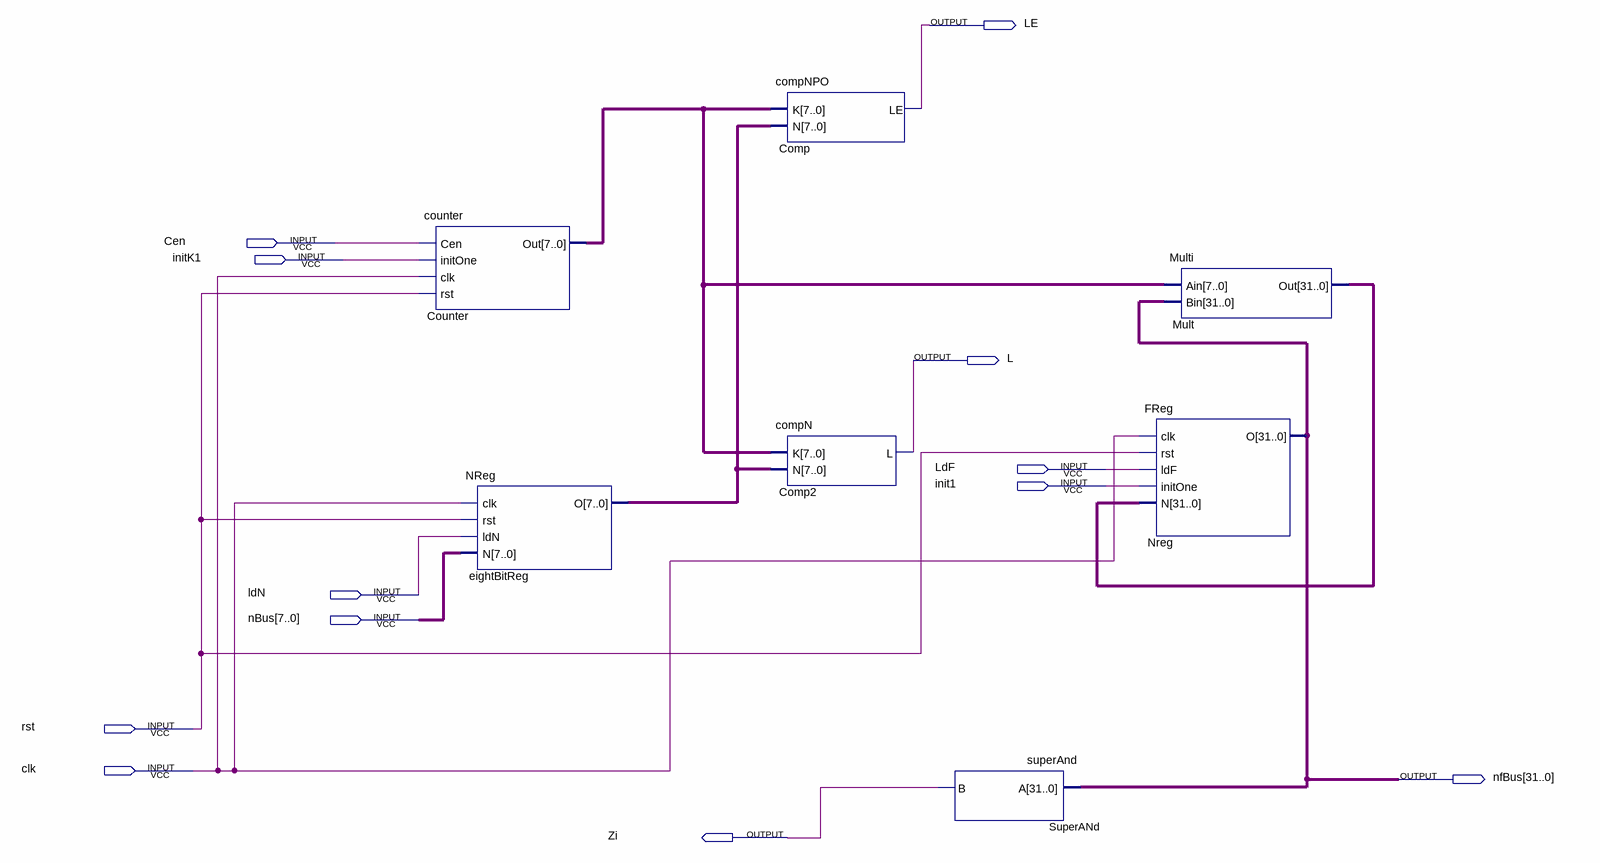
[diagram p0: schematic sheet]
// Quartus schematic CA5.bdf as structural Verilog: 7 symbols, 12 pins
module CA5 (
  input  Cen,
  input  initK1,
  input  LdF,
  input  init1,
  input  ldN,
  input  [7:0] nBus,
  input  rst,
  input  clk,
  output LE,
  output L,
  output [31:0] nfBus,
  output Zi
);

  wire [7:0] Counter_out, eightBitReg_o;
  wire [31:0] Mult_out;

  counter Counter (.Cen(Cen), .initOne(initK1), .clk(clk), .rst(rst), .Out(Counter_out));
  NReg eightBitReg (.clk(clk), .rst(rst), .ldN(ldN), .N(nBus), .O(eightBitReg_o));
  compNPO Comp (.K(Counter_out), .N(eightBitReg_o), .LE(LE));
  compN Comp2 (.K(Counter_out), .N(eightBitReg_o), .L(L));
  superAnd SuperANd (.A(nfBus), .B(Zi));
  FReg Nreg (.clk(clk), .rst(rst), .ldF(LdF), .initOne(init1), .N(Mult_out), .O(nfBus));
  Multi Mult (.Ain(Counter_out), .Bin(nfBus), .Out(Mult_out));
endmodule
